# Altium schematic sheet Connector.SchDoc: fhlkil
size A4; DrawnBy: dfdfdfdf; DocumentNumber: fdfdd; Revision: 0; SheetNumber: 1; SheetTotal: 12; DocumentName: fdfdfd; ProjectName: fddfdfd
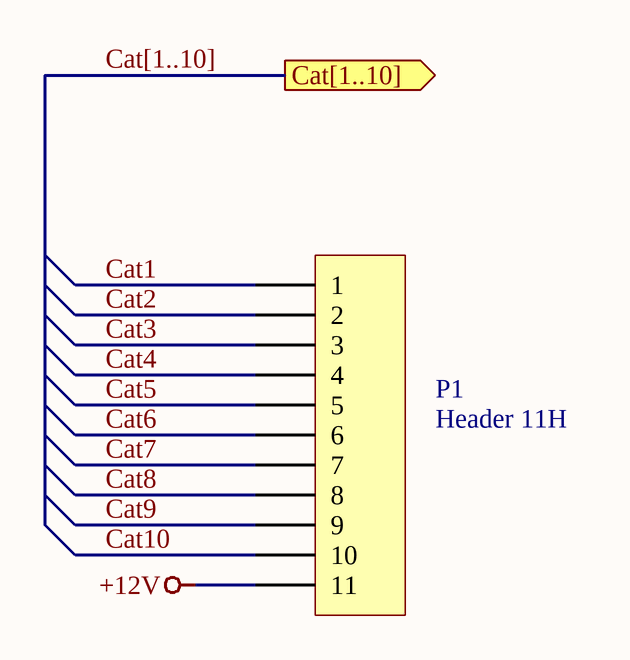
[diagram p0: Connector.SchDoc]

## Parts
P1  Header 11H  [HDR1X11H]

## Ports
Cat[1..10] (out)

## Nets
+12V: P1.11
Cat1: P1.1
Cat2: P1.2
Cat3: P1.3
Cat4: P1.4
Cat5: P1.5
Cat6: P1.6
Cat7: P1.7
Cat8: P1.8
Cat9: P1.9
Cat10: P1.10

## Buses and harness runs
bus Cat[1..10] = port Cat[1..10]

## Library data of the parts
P1 = Header 11H: Header, 11-Pin, Right Angle; LatestRevisionDate: 17-Jul-2002; LatestRevisionNote: Re-released for DXP Platform.; Publisher: Altium Limited